# Altium project Allochis_isobus_adapter_board_v1.0.PrjPcb
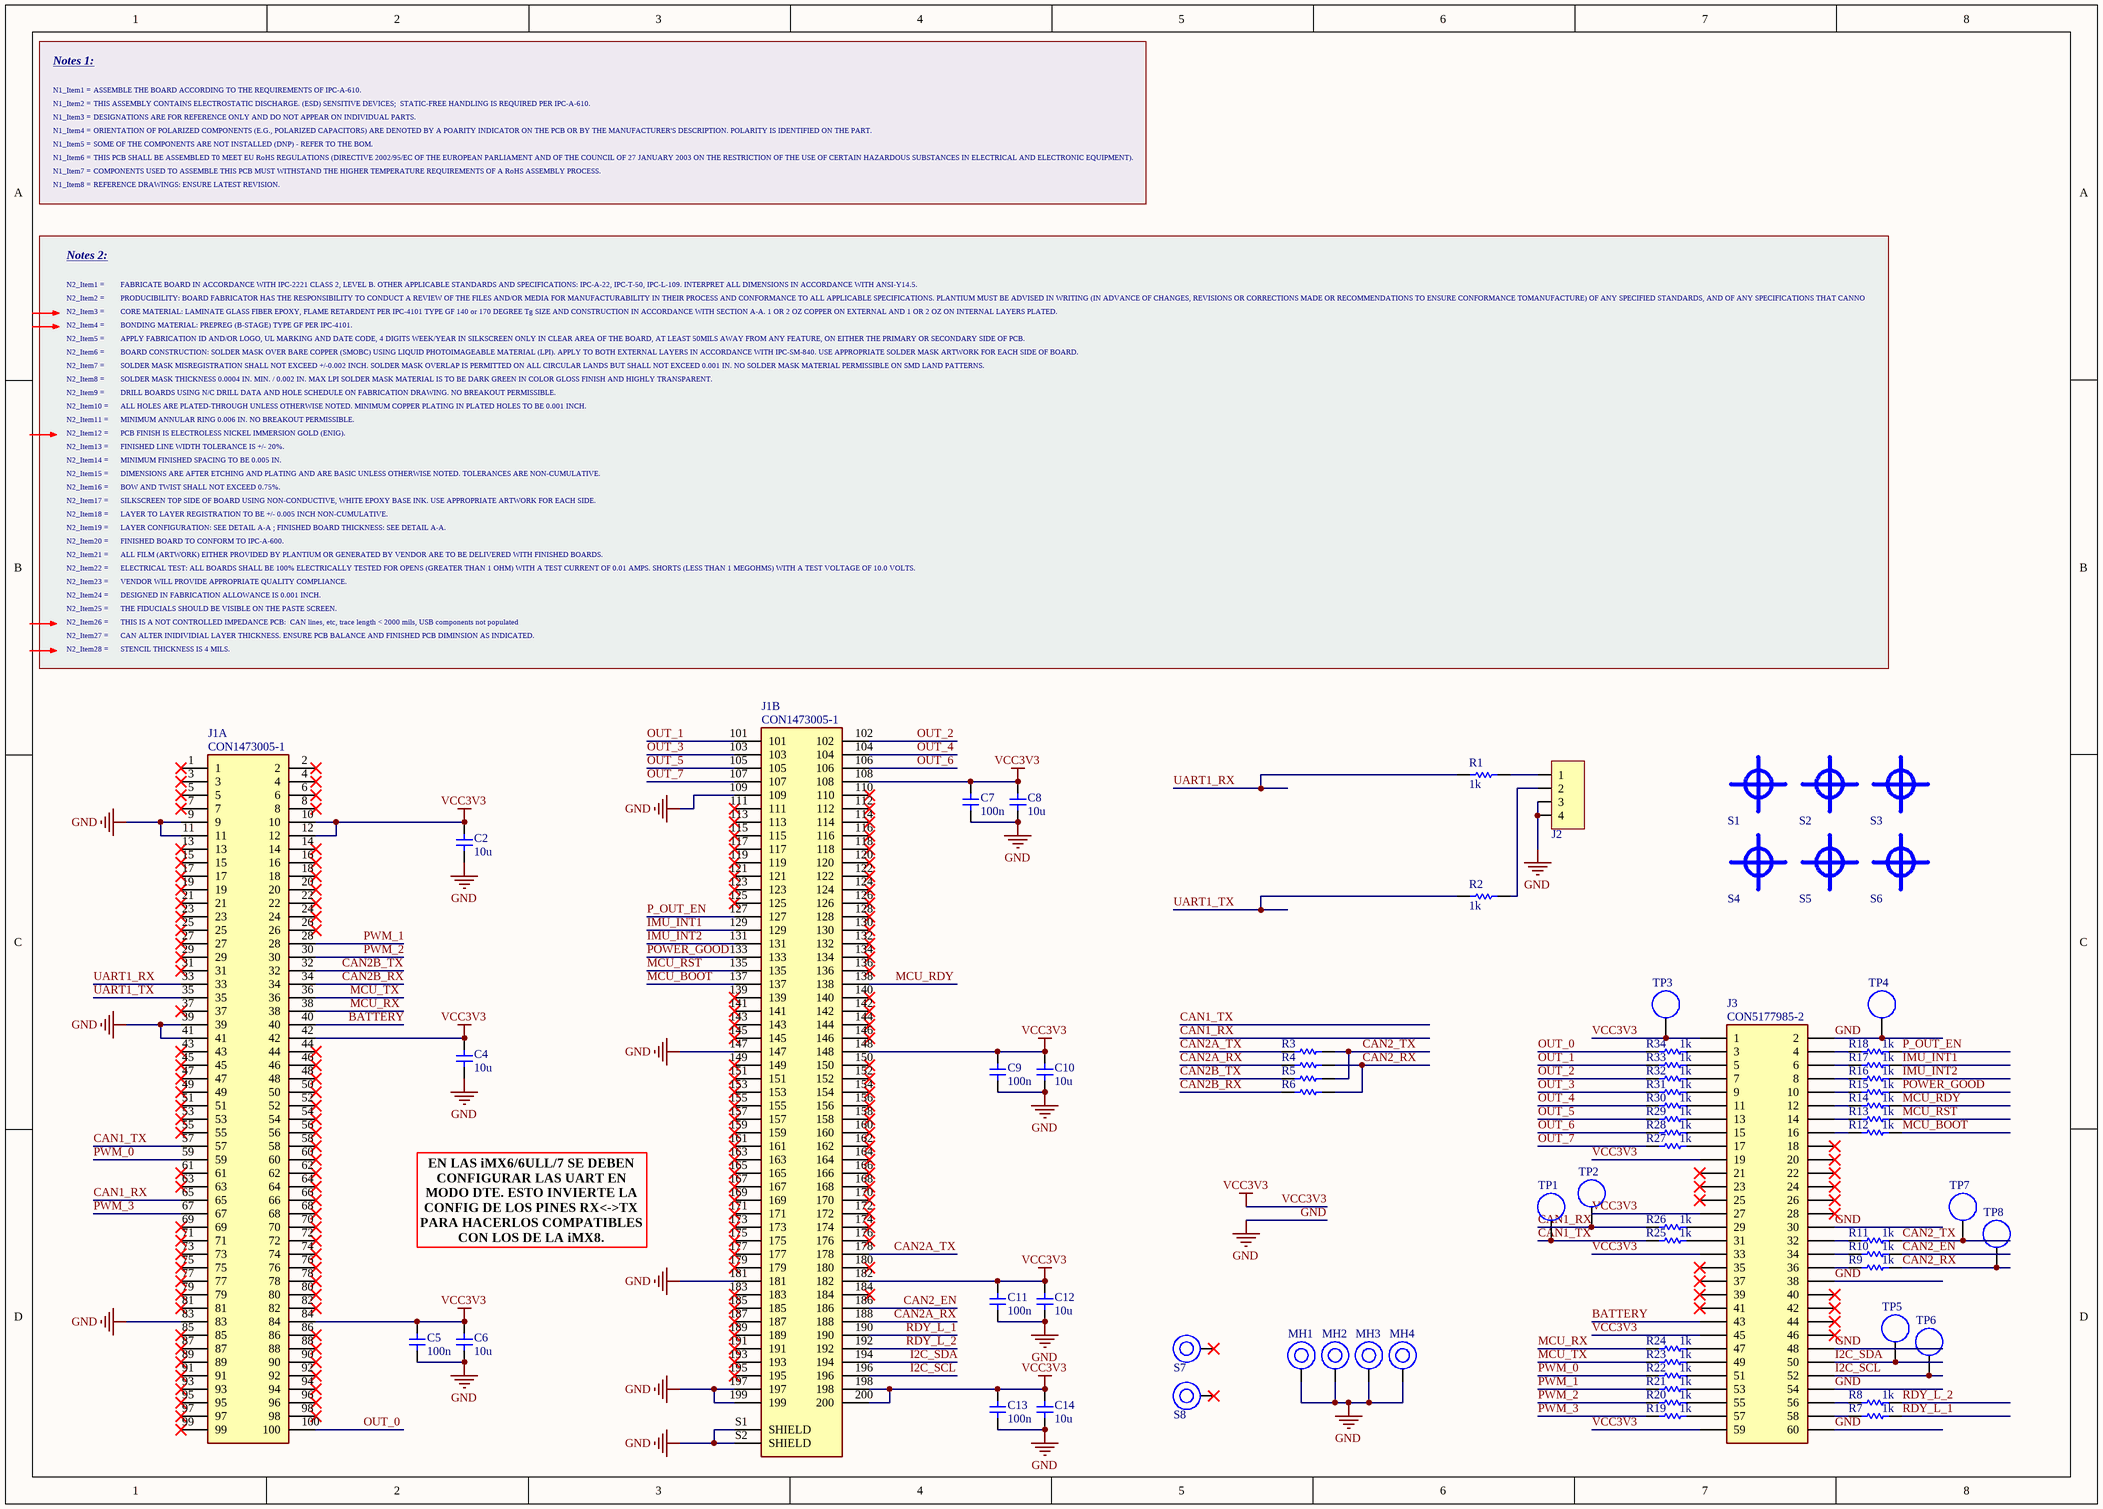
[diagram p0: ALLOCHIS_ADAPTER_v1.0.SchDoc]
1 sheet, 71 parts. Net scope: global (net labels, ports and power ports of the same name join across sheets).
Board files: ALLOCHIS_ADAPTER_v1.0.PcbDoc, ALLOCHIS_ADAPTER_panelizado_v1.0.PcbDoc

## Sheet ALLOCHIS_ADAPTER_v1.0.SchDoc: ALLOCHIS_ADAPTER
size A3; CheckedBy: GS; DrawnBy: LE; Organization: Plantium; Address1: San Luis 279; Address2: Villa Constitución, CP2919; Address3: Santa Fe, Argentina.; Revision: 1.0; SheetNumber: 1; SheetTotal: 1

### Parts
AssemblyNotes  N1_Item8: REFERENCE DRAWINGS: ENSURE LATEST REVISION.  N1_Item7: COMPONENTS USED TO ASSEMBLE THIS PCB MUST WITHSTAND THE HIGHER TEMPERATURE REQUIREMENTS OF A RoHS ASSEMBLY PROCESS.  N1_Item6: THIS PCB SHALL BE ASSEMBLED T0 MEET EU RoHS REGULATIONS (DIRECTIVE 2002/95/EC OF THE EUROPEAN PARLIAMENT AND OF THE COUNCIL OF 27 JANUARY 2003 ON THE RESTRICTION OF THE USE OF CERTAIN HAZARDOUS SUBSTANCES IN ELECTRICAL AND ELECTRONIC EQUIPMENT).  N1_Item5: SOME OF THE COMPONENTS ARE NOT INSTALLED (DNP) - REFER TO THE BOM.  N1_Item4: ORIENTATION OF POLARIZED COMPONENTS (E.G., POLARIZED CAPACITORS) ARE DENOTED BY A POARITY INDICATOR ON THE PCB OR BY THE MANUFACTURER'S DESCRIPTION. POLARITY IS IDENTIFIED ON THE PART.  N1_Item3: DESIGNATIONS ARE FOR REFERENCE ONLY AND DO NOT APPEAR ON INDIVIDUAL PARTS.  N1_Item2: THIS ASSEMBLY CONTAINS ELECTROSTATIC DISCHARGE. (ESD) SENSITIVE DEVICES;  STATIC-FREE HANDLING IS REQUIRED PER IPC-A-610.  N1_Item1: ASSEMBLE THE BOARD ACCORDING TO THE REQUIREMENTS OF IPC-A-610.  [ASSNOTES]  (hidden comment: AssemblyNotes)  (no BOM)
C2  value 10u  [C1206]  (hidden comment: CC106HKB1206W)
C4  value 10u  [C1206]  (hidden comment: CC106HKB1206W)
C5  value 100n  [C0603]  (hidden comment: CC104HKB0603W)
C6  value 10u  [C1206]  (hidden comment: CC106HKB1206W)
C7  value 100n  [C0603]  (hidden comment: CC104HKB0603W)
C8  value 10u  [C1206]  (hidden comment: CC106HKB1206W)
C9  value 100n  [C0603]  (hidden comment: CC104HKB0603W)
C10  value 10u  [C1206]  (hidden comment: CC106HKB1206W)
C11  value 100n  [C0603]  (hidden comment: CC104HKB0603W)
C12  value 10u  [C1206]  (hidden comment: CC106HKB1206W)
C13  value 100n  [C0603]  (hidden comment: CC104HKB0603W)
C14  value 10u  [C1206]  (hidden comment: CC106HKB1206W)
Fabrication_Notes  N2_Item28: STENCIL THICKNESS IS 4 MILS.  N2_Item27: CAN ALTER INIDIVIDIAL LAYER THICKNESS. ENSURE PCB BALANCE AND FINISHED PCB DIMINSION AS INDICATED.  N2_Item26: THIS IS A NOT CONTROLLED IMPEDANCE PCB:  CAN lines, etc, trace length < 2000 mils, USB components not populated  N2_Item25: THE FIDUCIALS SHOULD BE VISIBLE ON THE PASTE SCREEN.  N2_Item24: DESIGNED IN FABRICATION ALLOWANCE IS 0.001 INCH.  N2_Item23: VENDOR WILL PROVIDE APPROPRIATE QUALITY COMPLIANCE.  N2_Item22: ELECTRICAL TEST: ALL BOARDS SHALL BE 100% ELECTRICALLY TESTED FOR OPENS (GREATER THAN 1 OHM) WITH A TEST CURRENT OF 0.01 AMPS. SHORTS (LESS THAN 1 MEGOHMS) WITH A TEST VOLTAGE OF 10.0 VOLTS.  N2_Item21: ALL FILM (ARTWORK) EITHER PROVIDED BY PLANTIUM OR GENERATED BY VENDOR ARE TO BE DELIVERED WITH FINISHED BOARDS.  N2_Item20: FINISHED BOARD TO CONFORM TO IPC-A-600.  N2_Item19: LAYER CONFIGURATION: SEE DETAIL A-A ; FINISHED BOARD THICKNESS: SEE DETAIL A-A.  N2_Item18: LAYER TO LAYER REGISTRATION TO BE +/- 0.005 INCH NON-CUMULATIVE.  N2_Item17: SILKSCREEN TOP SIDE OF BOARD USING NON-CONDUCTIVE, WHITE EPOXY BASE INK. USE APPROPRIATE ARTWORK FOR EACH SIDE.  N2_Item16: BOW AND TWIST SHALL NOT EXCEED 0.75%.  N2_Item15: DIMENSIONS ARE AFTER ETCHING AND PLATING AND ARE BASIC UNLESS OTHERWISE NOTED. TOLERANCES ARE NON-CUMULATIVE.  N2_Item14: MINIMUM FINISHED SPACING TO BE 0.005 IN.  N2_Item13: FINISHED LINE WIDTH TOLERANCE IS +/- 20%.  N2_Item12: PCB FINISH IS ELECTROLESS NICKEL IMMERSION GOLD (ENIG).  N2_Item11: MINIMUM ANNULAR RING 0.006 IN. NO BREAKOUT PERMISSIBLE.  N2_Item10: ALL HOLES ARE PLATED-THROUGH UNLESS OTHERWISE NOTED. MINIMUM COPPER PLATING IN PLATED HOLES TO BE 0.001 INCH.  N2_Item9: DRILL BOARDS USING N/C DRILL DATA AND HOLE SCHEDULE ON FABRICATION DRAWING. NO BREAKOUT PERMISSIBLE.  N2_Item8: SOLDER MASK THICKNESS 0.0004 IN. MIN. / 0.002 IN. MAX LPI SOLDER MASK MATERIAL IS TO BE DARK GREEN IN COLOR GLOSS FINISH AND HIGHLY TRANSPARENT.  N2_Item7: SOLDER MASK MISREGISTRATION SHALL NOT EXCEED +/-0.002 INCH. SOLDER MASK OVERLAP IS PERMITTED ON ALL CIRCULAR LANDS BUT SHALL NOT EXCEED 0.001 IN. NO SOLDER MASK MATERIAL PERMISSIBLE ON SMD LAND PATTERNS.  N2_Item6: BOARD CONSTRUCTION: SOLDER MASK OVER BARE COPPER (SMOBC) USING LIQUID PHOTOIMAGEABLE MATERIAL (LPI). APPLY TO BOTH EXTERNAL LAYERS IN ACCORDANCE WITH IPC-SM-840. USE APPROPRIATE SOLDER MASK ARTWORK FOR EACH SIDE OF BOARD.  N2_Item5: APPLY FABRICATION ID AND/OR LOGO, UL MARKING AND DATE CODE, 4 DIGITS WEEK/YEAR IN SILKSCREEN ONLY IN CLEAR AREA OF THE BOARD, AT LEAST 50MILS AWAY FROM ANY FEATURE, ON EITHER THE PRIMARY OR SECONDARY SIDE OF PCB.  N2_Item4: BONDING MATERIAL: PREPREG (B-STAGE) TYPE GF PER IPC-4101.  N2_Item3: CORE MATERIAL: LAMINATE GLASS FIBER EPOXY, FLAME RETARDENT PER IPC-4101 TYPE GF 140 or 170 DEGREE Tg SIZE AND CONSTRUCTION IN ACCORDANCE WITH SECTION A-A. 1 OR 2 OZ COPPER ON EXTERNAL AND 1 OR 2 OZ ON INTERNAL LAYERS PLATED.  N2_Item2: PRODUCIBILITY: BOARD FABRICATOR HAS THE RESPONSIBILITY TO CONDUCT A REVIEW OF THE FILES AND/OR MEDIA FOR MANUFACTURABILITY IN THEIR PROCESS AND CONFORMANCE TO ALL APPLICABLE SPECIFICATIONS. PLANTIUM MUST BE ADVISED IN WRITING (IN ADVANCE OF CHANGES, REVISIONS OR CORRECTIONS MADE OR RECOMMENDATIONS TO ENSURE CONFORMANCE TOMANUFACTURE) OF ANY SPECIFIED STANDARDS, AND OF ANY SPECIFICATIONS THAT CANNOT BE MET.  N2_Item1: FABRICATE BOARD IN ACCORDANCE WITH IPC-2221 CLASS 2, LEVEL B. OTHER APPLICABLE STANDARDS AND SPECIFICATIONS: IPC-A-22, IPC-T-50, IPC-L-109. INTERPRET ALL DIMENSIONS IN ACCORDANCE WITH ANSI-Y14.5.  [FABNOTES]  (hidden comment: FabricationNotes)  (no BOM)
J1  CON1473005-1  [TE_1473005-1 + SOM Toradex iMX]  (parts A,B of 2)
J2  CON-HEADER4  [HEADER4]  (value not drawn)  (no BOM)
J3  CON5177985-2  [TE_5177985-2]
MH1  Mounting_Hole  [mounting_hole]  (value not drawn)  (no BOM)
MH2  Mounting_Hole  [mounting_hole]  (value not drawn)  (no BOM)
MH3  Mounting_Hole  [mounting_hole]  (value not drawn)  (no BOM)
MH4  Mounting_Hole  [mounting_hole]  (value not drawn)  (no BOM)
R1  value 1k  [R0603]  (hidden comment: R1001RLF0603)
R2  value 1k  [R0603]  (hidden comment: R1001RLF0603)
R3  R0000RLX0603  [R0603]  (value not drawn)
R4  R0000RLX0603  [R0603]  (value not drawn)
R5  R0000RLX0603  [R0603]  (value not drawn)  (no BOM)
R6  R0000RLX0603  [R0603]  (value not drawn)  (no BOM)
R7  value 1k  [R0603]  (hidden comment: R1001RLF0603)
R8  value 1k  [R0603]  (hidden comment: R1001RLF0603)
R9  value 1k  [R0603]  (hidden comment: R1001RLF0603)
R10  value 1k  [R0603]  (hidden comment: R1001RLF0603)
R11  value 1k  [R0603]  (hidden comment: R1001RLF0603)
R12  value 1k  [R0603]  (hidden comment: R1001RLF0603)
R13  value 1k  [R0603]  (hidden comment: R1001RLF0603)
R14  value 1k  [R0603]  (hidden comment: R1001RLF0603)
R15  value 1k  [R0603]  (hidden comment: R1001RLF0603)
R16  value 1k  [R0603]  (hidden comment: R1001RLF0603)
R17  value 1k  [R0603]  (hidden comment: R1001RLF0603)
R18  value 1k  [R0603]  (hidden comment: R1001RLF0603)
R19  value 1k  [R0603]  (hidden comment: R1001RLF0603)
R20  value 1k  [R0603]  (hidden comment: R1001RLF0603)
R21  value 1k  [R0603]  (hidden comment: R1001RLF0603)
R22  value 1k  [R0603]  (hidden comment: R1001RLF0603)
R23  value 1k  [R0603]  (hidden comment: R1001RLF0603)
R24  value 1k  [R0603]  (hidden comment: R1001RLF0603)
R25  value 1k  [R0603]  (hidden comment: R1001RLF0603)
R26  value 1k  [R0603]  (hidden comment: R1001RLF0603)
R27  value 1k  [R0603]  (hidden comment: R1001RLF0603)
R28  value 1k  [R0603]  (hidden comment: R1001RLF0603)
R29  value 1k  [R0603]  (hidden comment: R1001RLF0603)
R30  value 1k  [R0603]  (hidden comment: R1001RLF0603)
R31  value 1k  [R0603]  (hidden comment: R1001RLF0603)
R32  value 1k  [R0603]  (hidden comment: R1001RLF0603)
R33  value 1k  [R0603]  (hidden comment: R1001RLF0603)
R34  value 1k  [R0603]  (hidden comment: R1001RLF0603)
S1  Fiducial  [FIDROUND1X2]  (value not drawn)  (no BOM)
S2  Fiducial  [FIDROUND1X2]  (value not drawn)  (no BOM)
S3  Fiducial  [FIDROUND1X2]  (value not drawn)  (no BOM)
S4  Fiducial  [FIDROUND1X2]  (value not drawn)  (no BOM)
S5  Fiducial  [FIDROUND1X2]  (value not drawn)  (no BOM)
S6  Fiducial  [FIDROUND1X2]  (value not drawn)  (no BOM)
S7  ACC74030243R  [9774030243]  (value not drawn)
S8  ACC74030243R  [9774030243]  (value not drawn)
TP1  Test_Point  [Test_point]  (value not drawn)  (no BOM)
TP2  Test_Point  [Test_point]  (value not drawn)  (no BOM)
TP3  Test_Point  [Test_point]  (value not drawn)  (no BOM)
TP4  Test_Point  [Test_point]  (value not drawn)  (no BOM)
TP5  Test_Point  [Test_point]  (value not drawn)  (no BOM)
TP6  Test_Point  [Test_point]  (value not drawn)  (no BOM)
TP7  Test_Point  [Test_point]  (value not drawn)  (no BOM)
TP8  Test_Point  [Test_point]  (value not drawn)  (no BOM)

### Nets
GND: C2.2 C4.2 C5.2 C6.2 C7.2 C8.2 C9.2 C10.2 C11.2 C12.2 C13.2 C14.2 J1.9 J1.11 J1.39 J1.41 J1.83 J1.109 J1.147 J1.181 J1.197 J1.199 J1.S1(SHIELD) J1.S2(SHIELD) J2.3 J2.4 J3.2 J3.30 J3.38 J3.48 J3.54 J3.60 MH1.1 MH2.1 MH3.1 MH4.1 TP4.1
VCC3V3: C2.1 C4.1 C5.1 C6.1 C7.1 C8.1 C9.1 C10.1 C11.1 C12.1 C13.1 C14.1 J1.10 J1.12 J1.42 J1.84 J1.108 J1.148 J1.182 J1.198 J1.200 J3.1 J3.19 J3.27 J3.33 J3.45 J3.59 TP3.1
BATTERY: J1.40 J3.43
CAN1_RX: J1.65 R26.1 TP2.1
CAN1_TX: J1.57 R25.1 TP1.1
CAN2_EN: J1.186 R10.2
CAN2_RX: R4.2 R6.2 R9.2 TP8.1
CAN2_TX: R3.2 R5.2 R11.2 TP7.1
CAN2A_RX: J1.188 R4.1
CAN2A_TX: J1.178 R3.1
CAN2B_RX: J1.34 R6.1
CAN2B_TX: J1.32 R5.1
I2C_SCL: J1.196 J3.52 TP6.1
I2C_SDA: J1.194 J3.50 TP5.1
IMU_INT1: J1.129 R17.2
IMU_INT2: J1.131 R16.2
MCU_BOOT: J1.137 R12.2
MCU_RDY: J1.138 R14.2
MCU_RST: J1.135 R13.2
MCU_RX: J1.38 R24.1
MCU_TX: J1.36 R23.1
OUT_0: J1.100 R34.1
OUT_1: J1.101 R33.1
OUT_2: J1.102 R32.1
OUT_3: J1.103 R31.1
OUT_4: J1.104 R30.1
OUT_5: J1.105 R29.1
OUT_6: J1.106 R28.1
OUT_7: J1.107 R27.1
P_OUT_EN: J1.127 R18.2
POWER_GOOD: J1.133 R15.2
PWM_0: J1.59 R22.1
PWM_1: J1.28 R21.1
PWM_2: J1.30 R20.1
PWM_3: J1.67 R19.1
RDY_L_1: J1.190 R7.2
RDY_L_2: J1.192 R8.2
UART1_RX: J1.33 R1.1
UART1_TX: J1.35 R2.1
NetJ2_1: J2.1 R1.2
NetJ2_2: J2.2 R2.2
NetJ3_3: J3.3 R34.2
NetJ3_4: J3.4 R18.1
NetJ3_5: J3.5 R33.2
NetJ3_6: J3.6 R17.1
NetJ3_7: J3.7 R32.2
NetJ3_8: J3.8 R16.1
NetJ3_9: J3.9 R31.2
NetJ3_10: J3.10 R15.1
NetJ3_11: J3.11 R30.2
NetJ3_12: J3.12 R14.1
NetJ3_13: J3.13 R29.2
NetJ3_14: J3.14 R13.1
NetJ3_15: J3.15 R28.2
NetJ3_16: J3.16 R12.1
NetJ3_17: J3.17 R27.2
NetJ3_29: J3.29 R26.2
NetJ3_31: J3.31 R25.2
NetJ3_32: J3.32 R11.1
NetJ3_34: J3.34 R10.1
NetJ3_36: J3.36 R9.1
NetJ3_47: J3.47 R24.2
NetJ3_49: J3.49 R23.2
NetJ3_51: J3.51 R22.2
NetJ3_53: J3.53 R21.2
NetJ3_55: J3.55 R20.2
NetJ3_56: J3.56 R8.1
NetJ3_57: J3.57 R19.2
NetJ3_58: J3.58 R7.1

Not connected (* = marked no-connect by the designer): J1 1* 2* 3* 4* 5* 6* 7* 8* 13* 14* 15* 16* 17* 18* 19* 20* 21* 22* 23* 24* 25* 26* 27* 29* 31* 37* 43* 44* 45* 46* 47* 48* 49* 50* 51* 52* 53* 54* 55* 56* 58* 60* 61* 62* 63* 64* 66* 68* 69* 70* 71* 72* 73* 74* 75* 76* 77* 78* 79* 80* 81* 82* 85* 86* 87* 88* 89* 90* 91* 92* 93* 94* 95* 96* 97* 98* 99* 110* 111* 112* 113* 114* 115* 116* 117* 118* 119* 120* 121* 122* 123* 124* 125* 126* 128* 130* 132* 134* 136* 139* 140* 141* 142* 143* 144* 145* 146* 149* 150* 151* 152* 153* 154* 155* 156* 157* 158* 159* 160* 161* 162* 163* 164* 165* 166* 167* 168* 169* 170* 171* 172* 173* 174* 175* 176* 177* 179* 180* 183* 184* 185* 187* 189* 191* 193* 195*; J3 18* 20* 21* 22* 23* 24* 25* 26* 28* 35* 37* 39* 40* 41* 42* 44* 46*; S7 1*; S8 1*

### Notes on the sheet
- EN LAS iMX6/6ULL/7 SE DEBEN CONFIGURAR LAS UART EN MODO DTE. ESTO INVIERTE LA CONFIG DE LOS PINES RX<->TX PARA HACERLOS COMPATIBLES CON LOS DE LA iMX8.
- Title
- Drawn by:
- Checked by:
- Sheet
- Date
- Ver.
- of
- File:
- (in symbol AssemblyNotes) Notes 1:; N1_Item1 =; N1_Item2 =; N1_Item3 =; N1_Item4 =; N1_Item5 =; N1_Item6 =; N1_Item7 =; N1_Item8 =
- (in symbol FabricationNotes) Notes 2:; N2_Item1 =; N2_Item2 =; N2_Item3 =; N2_Item4 =; N2_Item5 =; N2_Item6 =; N2_Item7 =; N2_Item8 =; N2_Item9 =; N2_Item10 =; N2_Item11 =; N2_Item12 =; N2_Item13 =; N2_Item14 =; N2_Item15 =; N2_Item16 =; N2_Item17 =; N2_Item18 =; N2_Item19 =; N2_Item20 =; N2_Item21 =; N2_Item22 =; N2_Item23 =; N2_Item24 =; N2_Item25 =; N2_Item26 =; N2_Item27 =; N2_Item28 =

### Library data of the parts
AssemblyNotes = AssemblyNotes: Assembly Notes
C2 C4 C6 C8 C10 C12 C14 = CC106HKB1206W: 10 µF ±10% 50V Ceramic Capacitor X7R 1206 (3216 Metric); Manufacturer Part Number: CL31B106KBHNNNE; Manufacturer: Samsung Electro-Mechanics; Working Temperature: -55°C ~ 125°C; Short Description: CAP CER 10UF 50V X7R 1206; Power: NC; Ratings: REACH, ROHS3; Type: MLCC; Temperature Coefficient: X7R; Mounting: SMT; Frequency: NC; Alternate Part Number 1: *; Alternate Part Number 2: *; Tolerance: ±10%; Current: NC; Revision Date: 03/08/21; Package Reference: 1206; Voltage: 50V
C5 C7 C9 C11 C13 = CC104HKB0603W: 100 nF ±10% 50V Ceramic Capacitor X7R 0603 (1608 Metric); Manufacturer Part Number: C0603C104K5RACTU; Manufacturer: KEMET; Working Temperature: -55°C ~ 125°C; Short Description: CAP CER 0.1UF 50V X7R 0603; Power: NC; Ratings: REACH, ROHS3; Type: MLCC; Temperature Coefficient: X7R; Mounting: SMT; Frequency: NC; Alternate Part Number 1: *; Alternate Part Number 2: *; Tolerance: ±10%; Current: NC; Revision Date: 02/08/21; Package Reference: 0603; Voltage: 50V
Fabrication_Notes = FabricationNotes: Fabrication Notes
J1 = CON1473005-1: 200 Position Dual Row Right Angle Double Data Rate SO DIMM Memory Card Socket; Manufacturer: TE Connectivity; Value: *; Manufacturer Part Number: 1473005-1; Datasheet: https://www.te.com/usa-en/product-1473005-1.html; Price: None; Package: None
J2 = CON-HEADER4: Header, 4-Pin; Short Description: Connector Header 4 pin; Value: 4; Manufacturer Part Number: *; Working Temperature: *; Temperature Coefficient: *; Mounting: THT; Power: *; Ratings: *; Type: *; Frequency: *; Alternate Part Number 1: *; Alternate Part Number 2: *; Manufacturer: *; Tolerance: *; Current: *; Revision Date: 13/10/21; Package Reference: *; Voltage: *
J3 = CON5177985-2: 60 Position Connector Receptacle, SMD, pitch 0.8mm; Manufacturer: TE Connectivity AMP Connectors; Short Description: Board to Board & Mezzanine Connectors 0.8MM-05H REC 2X030P; Ratings: RoHS; Value: 60; Manufacturer Part Number: 5177985-2; Working Temperature: *; Temperature Coefficient: *; Mounting: Surface Mount; Power: *; Type: *; Frequency: *; Alternate Part Number 1: *; Alternate Part Number 2: *; Tolerance: *; Current: *; Revision Date: 02/06/23; Package Reference: Tape & Reel (TR); Voltage: *
MH1-MH4 = Mounting_Hole: Mounting Hole; Manufacturer Part Number: NC; Mounting: NC; Value: NC; Working Temperature: NC; Temperature Coefficient: NC; Short Description: Mounting Hole; Power: NC; Ratings: NC; Type: NC; Frequency: NC; Alternate Part Number 1: NC; Alternate Part Number 2: NC; Manufacturer: NC; Tolerance: NC; Current: NC; Revision Date: 03/04/23; Package Reference: NC; Voltage: NC
R1 R2 R7-R34 = R1001RLF0603: 1 kOhms ±1% 0.1W, 1/10W Chip Resistor 0603 (1608 Metric) Automotive AEC-Q200 Thick Film; Manufacturer Part Number: ERJ-3EKF1001V; Manufacturer: Panasonic Electronic Components; Working Temperature: -55°C ~ 155°C; Temperature Coefficient: ±100ppm/°C; Short Description: RES SMD 1K OHM 1% 1/10W 0603; Ratings: REACH, ROHS3, AEC-Q200; Frequency: NC; Mounting: SMT; Power: 1/10W; Type: NC; Alternate Part Number 1: *; Alternate Part Number 2: *; Tolerance: ±1%; Current: NC; Revision Date: 02/08/21; Package Reference: 0603; Voltage: NC
R3-R6 = R0000RLX0603: 0 Ohms Jumper 0.1W, 1/10W Chip Resistor 0603 (1608 Metric) Automotive AEC-Q200 Thick Film; Manufacturer Part Number: ERJ-3GEY0R00V; Manufacturer: Panasonic Electronic Components; Working Temperature: -55°C ~ 155°C; Short Description: RES SMD 0 OHM JUMPER 1/10W 0603; Ratings: REACH, ROHS3, AEC-Q200; Frequency: NC; Value: 0; Temperature Coefficient: *; Mounting: SMT; Power: 1/10W; Type: NC; Alternate Part Number 1: *; Alternate Part Number 2: *; Tolerance: *; Current: NC; Revision Date: 02/08/21; Package Reference: 0603; Voltage: NC
S1-S6 = Fiducial: Fiducial Mark; Working Temperature: NC; Short Description: Fiducail Mark; Value: NC; Temperature Coefficient: NC; Type: NC; Alternate Part Number 1: *; Alternate Part Number 2: *; Tolerance: NC; Revision Date: 31/1/23; Voltage: NC
S7 S8 = ACC74030243R: Steel Spacer. Round Standoff Threaded M2x0.4 Steel 0.118" (3.00mm); Manufacturer Part Number: 9774030243R; Manufacturer: Würth Elektronik; Working Temperature: -55º to 150º; Short Description: RND STANDOFF M2X0.4 STEEL 3MM; Temperature Coefficient: *; Mounting: SMD; Power: *; Ratings: *; Type: Round Standoff; Frequency: *; Alternate Part Number 1: *; Alternate Part Number 2: *; Tolerance: *; Current: *; Revision Date: 01/05/23; Package Reference: *; Voltage: *; Value: *
TP1-TP8 = Test_Point: Test point; Manufacturer Part Number: NC; Mounting: NC; Value: NC; Working Temperature: NC; Temperature Coefficient: NC; Short Description: Test point; Power: NC; Ratings: NC; Type: NC; Frequency: NC; Alternate Part Number 1: NC; Alternate Part Number 2: NC; Manufacturer: NC; Tolerance: NC; Current: NC; Revision Date: 03/04/23; Package Reference: NC; Voltage: NC